# Altium schematic sheet CLOCK.SchDoc
size 558 x 431 mm; SheetNumber: 5; SheetTotal: 25; Sheet_Name: CLOCK; Size: 11x17
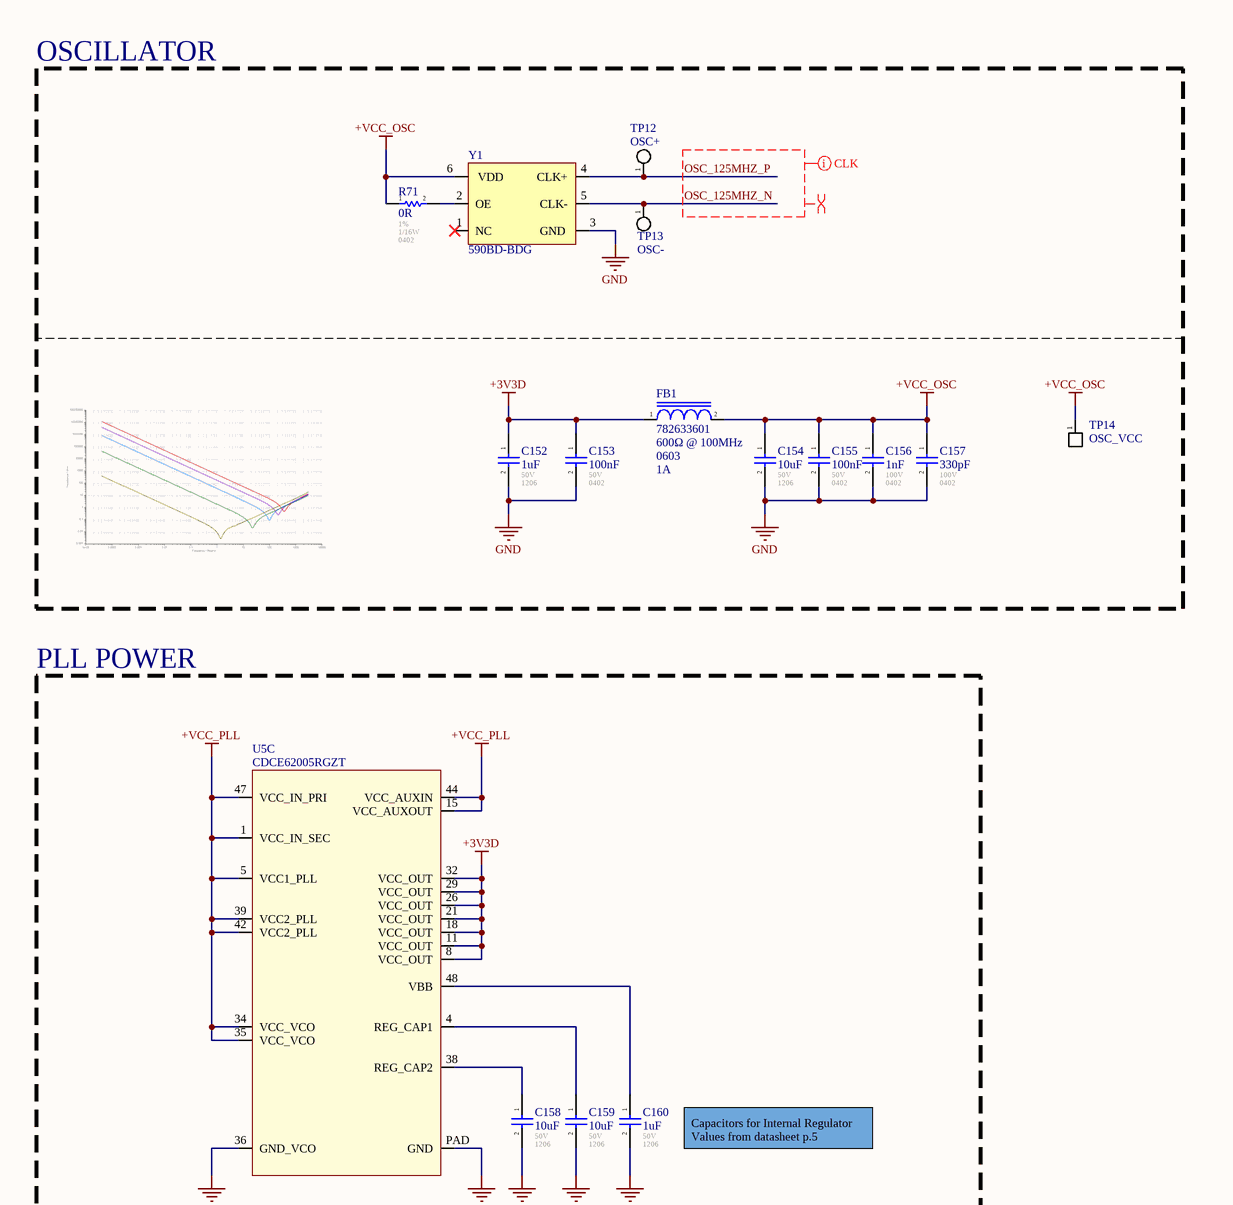
[diagram p0: CLOCK.SchDoc, top left]
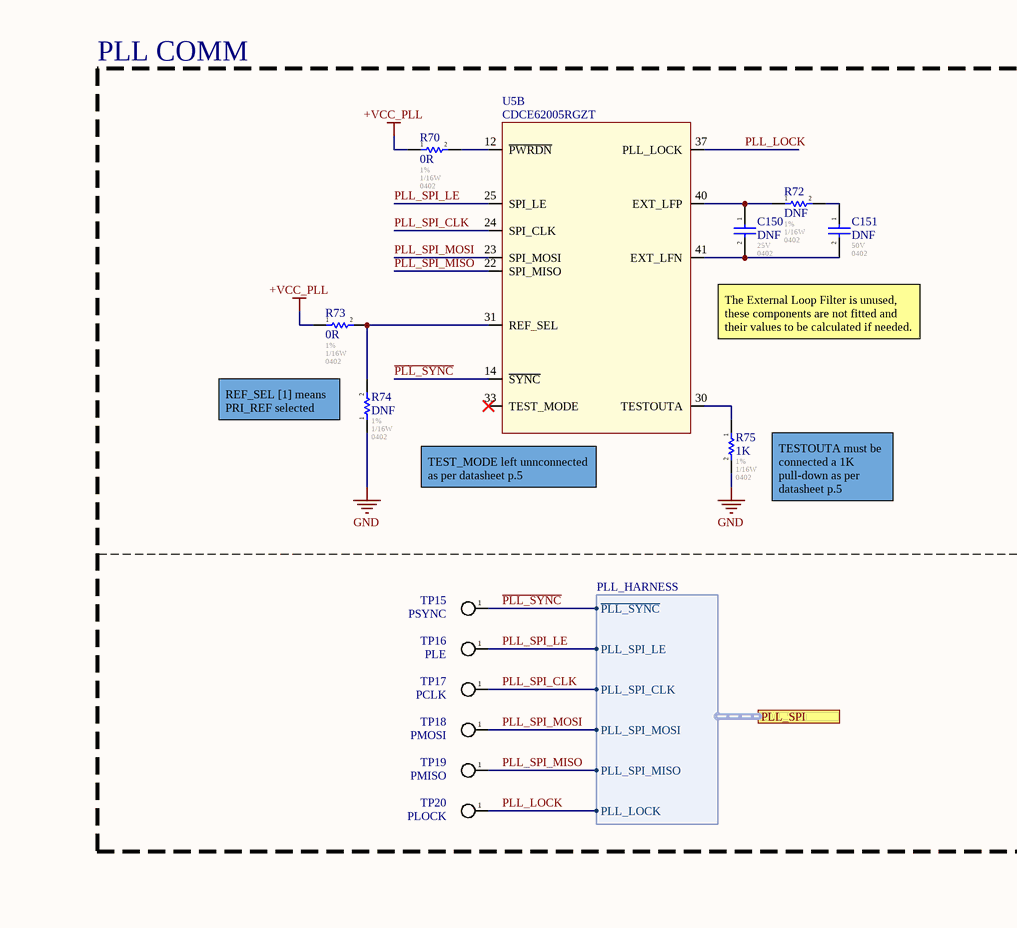
[diagram p1: CLOCK.SchDoc, top right]
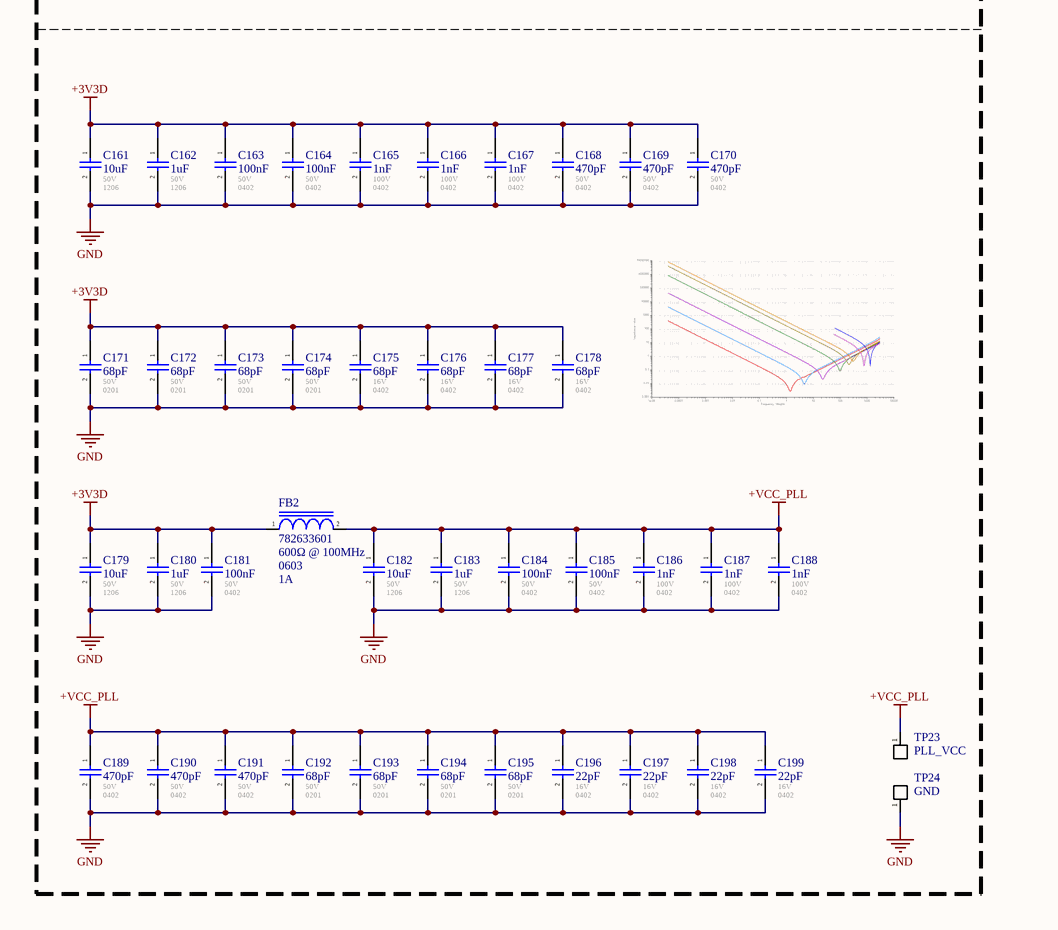
[diagram p2: CLOCK.SchDoc, bottom left]
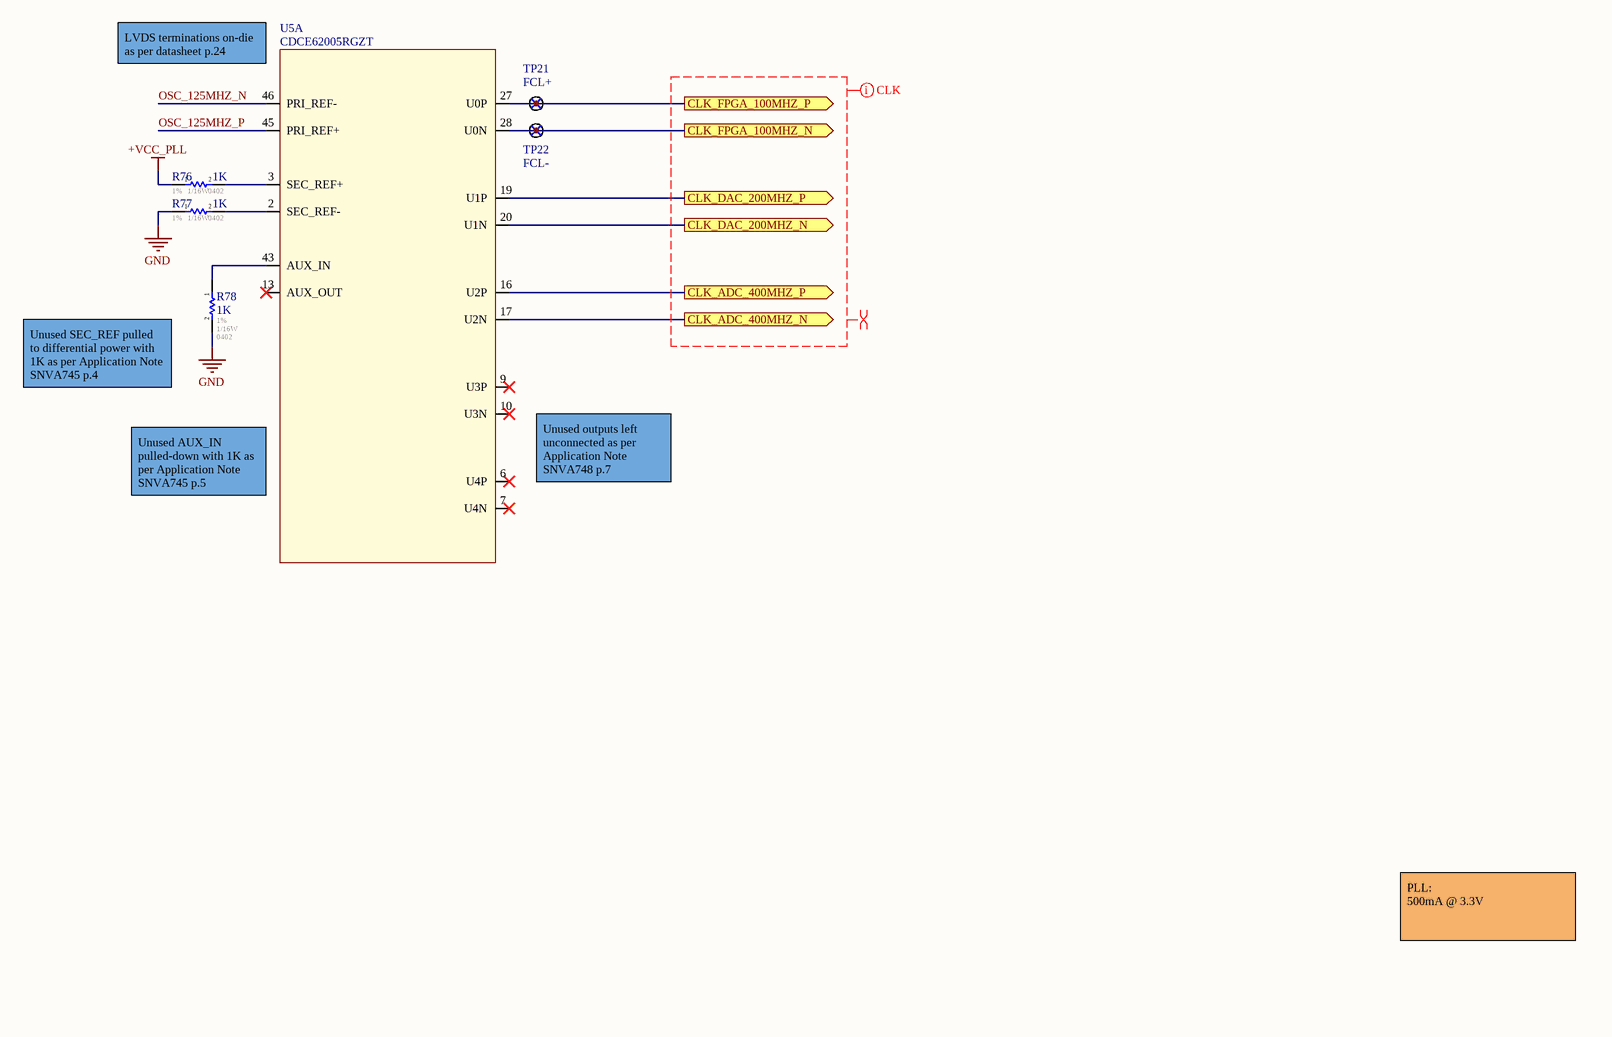
[diagram p3: CLOCK.SchDoc, bottom right]

## Parts
C150  DNF  Voltage - Rated: 25V  Footprint: 0402  [CAP_0402]
C151  DNF  Voltage - Rated: 50V  Footprint: 0402  [CAP_0402]
C152  1uF  Voltage - Rated: 50V  Footprint: 1206  [CAP_1206]
C153  100nF  Voltage - Rated: 50V  Footprint: 0402  [CAP_0402]
C154  10uF  Voltage - Rated: 50V  Footprint: 1206  [CAP_1206]
C155  100nF  Voltage - Rated: 50V  Footprint: 0402  [CAP_0402]
C156  1nF  Voltage - Rated: 100V  Footprint: 0402  [CAP_0402]
C157  330pF  Voltage - Rated: 100V  Footprint: 0402  [CAP_0402]
C158  10uF  Voltage - Rated: 50V  Footprint: 1206  [CAP_1206]
C159  10uF  Voltage - Rated: 50V  Footprint: 1206  [CAP_1206]
C160  1uF  Voltage - Rated: 50V  Footprint: 1206  [CAP_1206]
C161  10uF  Voltage - Rated: 50V  Footprint: 1206  [CAP_1206]
C162  1uF  Voltage - Rated: 50V  Footprint: 1206  [CAP_1206]
C163  100nF  Voltage - Rated: 50V  Footprint: 0402  [CAP_0402]
C164  100nF  Voltage - Rated: 50V  Footprint: 0402  [CAP_0402]
C165  1nF  Voltage - Rated: 100V  Footprint: 0402  [CAP_0402]
C166  1nF  Voltage - Rated: 100V  Footprint: 0402  [CAP_0402]
C167  1nF  Voltage - Rated: 100V  Footprint: 0402  [CAP_0402]
C168  470pF  Voltage - Rated: 50V  Footprint: 0402  [CAP_0402]
C169  470pF  Voltage - Rated: 50V  Footprint: 0402  [CAP_0402]
C170  470pF  Voltage - Rated: 50V  Footprint: 0402  [CAP_0402]
C171  68pF  Voltage - Rated: 50V  Footprint: 0201  [CAP_0402]
C172  68pF  Voltage - Rated: 50V  Footprint: 0201  [CAP_0402]
C173  68pF  Voltage - Rated: 50V  Footprint: 0201  [CAP_0402]
C174  68pF  Voltage - Rated: 50V  Footprint: 0201  [CAP_0402]
C175  68pF  Voltage - Rated: 16V  Footprint: 0402  [CAP_0402]
C176  68pF  Voltage - Rated: 16V  Footprint: 0402  [CAP_0402]
C177  68pF  Voltage - Rated: 16V  Footprint: 0402  [CAP_0402]
C178  68pF  Voltage - Rated: 16V  Footprint: 0402  [CAP_0402]
C179  10uF  Voltage - Rated: 50V  Footprint: 1206  [CAP_1206]
C180  1uF  Voltage - Rated: 50V  Footprint: 1206  [CAP_1206]
C181  100nF  Voltage - Rated: 50V  Footprint: 0402  [CAP_0402]
C182  10uF  Voltage - Rated: 50V  Footprint: 1206  [CAP_1206]
C183  1uF  Voltage - Rated: 50V  Footprint: 1206  [CAP_1206]
C184  100nF  Voltage - Rated: 50V  Footprint: 0402  [CAP_0402]
C185  100nF  Voltage - Rated: 50V  Footprint: 0402  [CAP_0402]
C186  1nF  Voltage - Rated: 100V  Footprint: 0402  [CAP_0402]
C187  1nF  Voltage - Rated: 100V  Footprint: 0402  [CAP_0402]
C188  1nF  Voltage - Rated: 100V  Footprint: 0402  [CAP_0402]
C189  470pF  Voltage - Rated: 50V  Footprint: 0402  [CAP_0402]
C190  470pF  Voltage - Rated: 50V  Footprint: 0402  [CAP_0402]
C191  470pF  Voltage - Rated: 50V  Footprint: 0402  [CAP_0402]
C192  68pF  Voltage - Rated: 50V  Footprint: 0201  [CAP_0402]
C193  68pF  Voltage - Rated: 50V  Footprint: 0201  [CAP_0402]
C194  68pF  Voltage - Rated: 50V  Footprint: 0201  [CAP_0402]
C195  68pF  Voltage - Rated: 50V  Footprint: 0201  [CAP_0402]
C196  22pF  Voltage - Rated: 16V  Footprint: 0402  [CAP_0402]
C197  22pF  Voltage - Rated: 16V  Footprint: 0402  [CAP_0402]
C198  22pF  Voltage - Rated: 16V  Footprint: 0402  [CAP_0402]
C199  22pF  Voltage - Rated: 16V  Footprint: 0402  [CAP_0402]
FB1  782633601  Impedance @ Freq: 600Ω @ 100MHz  Package / Case: 0603  Current Rating: 1A  [IND_0603]
FB2  782633601  Impedance @ Freq: 600Ω @ 100MHz  Package / Case: 0603  Current Rating: 1A  [IND_0603]
R70  0R  Tolerance: 1%  Power: 1/16W  Package / Case: 0402  [RES_0402]
R71  0R  Tolerance: 1%  Power: 1/16W  Package / Case: 0402  [RES_0402]
R72  DNF  Tolerance: 1%  Power: 1/16W  Package / Case: 0402  [RES_0402]
R73  0R  Tolerance: 1%  Power: 1/16W  Package / Case: 0402  [RES_0402]
R74  DNF  Tolerance: 1%  Power: 1/16W  Package / Case: 0402  [RES_0402]
R75  1K  Tolerance: 1%  Power: 1/16W  Package / Case: 0402  [RES_0402]
R76  1K  Tolerance: 1%  Power: 1/16W  Package / Case: 0402  [RES_0402]
R77  1K  Tolerance: 1%  Power: 1/16W  Package / Case: 0402  [RES_0402]
R78  1K  Tolerance: 1%  Power: 1/16W  Package / Case: 0402  [RES_0402]
TP12  OSC+  [TP_PAD_SMALL]  (no BOM)
TP13  OSC-  [TP_PAD_SMALL]  (no BOM)
TP14  OSC_VCC  [TP_PAD]  (no BOM)
TP15  PSYNC  [TP_PAD_SMALL]  (no BOM)
TP16  PLE  [TP_PAD_SMALL]  (no BOM)
TP17  PCLK  [TP_PAD_SMALL]  (no BOM)
TP18  PMOSI  [TP_PAD_SMALL]  (no BOM)
TP19  PMISO  [TP_PAD_SMALL]  (no BOM)
TP20  PLOCK  [TP_PAD_SMALL]  (no BOM)
TP21  FCL+  [TP_PAD_TINY]  (no BOM)
TP22  FCL-  [TP_PAD_TINY]  (no BOM)
TP23  PLL_VCC  [TP_PAD]  (no BOM)
TP24  GND  [TP_PAD]  (no BOM)
U5  CDCE62005RGZT  [TIM_CDCE62005RGZT]  (parts A,B,C of 3)
Y1  590BD-BDG  [OSC_590BD-BDG]

## Blocks framed on the sheet
OSCILLATOR: C152-C157 FB1 R71 TP12-TP14 Y1
PLL COMM: C150 C151 R70 R72-R75 TP15-TP20 U5
PLL POWER: C158-C199 FB2 TP23 TP24 U5

## Ports
CLK_ADC_400MHZ_N (out), CLK_ADC_400MHZ_P (out), CLK_DAC_200MHZ_N (out), CLK_DAC_200MHZ_P (out), CLK_FPGA_100MHZ_N (out), CLK_FPGA_100MHZ_P (out), PLL_SPI (harness PLL_HARNESS)

## Harnesses
PLL_HARNESS: ~{PLL_SYNC}, PLL_SPI_LE, PLL_SPI_CLK, PLL_SPI_MOSI, PLL_SPI_MISO, PLL_LOCK

## Nets
+3V3D: C152.1 C153.1 C161.1 C162.1 C163.1 C164.1 C165.1 C166.1 C167.1 C168.1 C169.1 C170.1 C171.1 C172.1 C173.1 C174.1 C175.1 C176.1 C177.1 C178.1 C179.1 C180.1 C181.1 FB1.1 FB2.1 U5.8(VCC_OUT) U5.11(VCC_OUT) U5.18(VCC_OUT) U5.21(VCC_OUT) U5.26(VCC_OUT) U5.29(VCC_OUT) U5.32(VCC_OUT)
+VCC_OSC: C154.1 C155.1 C156.1 C157.1 FB1.2 R71.1 TP14.1(A) Y1.6(VDD)
+VCC_PLL: C182.1 C183.1 C184.1 C185.1 C186.1 C187.1 C188.1 C189.1 C190.1 C191.1 C192.1 C193.1 C194.1 C195.1 C196.1 C197.1 C198.1 C199.1 FB2.2 R70.1 R73.1 R76.1 TP23.1(A) U5.1(VCC_IN_SEC) U5.5(VCC1_PLL) U5.15(VCC_AUXOUT) U5.34(VCC_VCO) U5.35(VCC_VCO) U5.39(VCC2_PLL) U5.42(VCC2_PLL) U5.44(VCC_AUXIN) U5.47(VCC_IN_PRI)
GND: C152.2 C153.2 C154.2 C155.2 C156.2 C157.2 C158.2 C159.2 C160.2 C161.2 C162.2 C163.2 C164.2 C165.2 C166.2 C167.2 C168.2 C169.2 C170.2 C171.2 C172.2 C173.2 C174.2 C175.2 C176.2 C177.2 C178.2 C179.2 C180.2 C181.2 C182.2 C183.2 C184.2 C185.2 C186.2 C187.2 C188.2 C189.2 C190.2 C191.2 C192.2 C193.2 C194.2 C195.2 C196.2 C197.2 C198.2 C199.2 R74.1 R75.2 R77.1 R78.2 TP24.1(A) U5.36(GND_VCO) U5.PAD(GND) Y1.3(GND)
~{PLL_SYNC}: TP15.1(A) U5.14(~{SYNC}) ; port PLL_SPI.~{PLL_SYNC}
CLK_ADC_400MHZ_N: U5.17(U2N) ; port CLK_ADC_400MHZ_N
CLK_ADC_400MHZ_P: U5.16(U2P) ; port CLK_ADC_400MHZ_P
CLK_DAC_200MHZ_N: U5.20(U1N) ; port CLK_DAC_200MHZ_N
CLK_DAC_200MHZ_P: U5.19(U1P) ; port CLK_DAC_200MHZ_P
CLK_FPGA_100MHZ_N: TP22.1(A) U5.28(U0N) ; port CLK_FPGA_100MHZ_N
CLK_FPGA_100MHZ_P: TP21.1(A) U5.27(U0P) ; port CLK_FPGA_100MHZ_P
OSC_125MHZ_N: TP13.1(A) U5.46(PRI_REF-) Y1.5(CLK-)
OSC_125MHZ_P: TP12.1(A) U5.45(PRI_REF+) Y1.4(CLK+)
PLL_LOCK: TP20.1(A) U5.37(PLL_LOCK) ; port PLL_SPI.PLL_LOCK
PLL_SPI_CLK: TP17.1(A) U5.24(SPI_CLK) ; port PLL_SPI.PLL_SPI_CLK
PLL_SPI_LE: TP16.1(A) U5.25(SPI_LE) ; port PLL_SPI.PLL_SPI_LE
PLL_SPI_MISO: TP19.1(A) U5.22(SPI_MISO) ; port PLL_SPI.PLL_SPI_MISO
PLL_SPI_MOSI: TP18.1(A) U5.23(SPI_MOSI) ; port PLL_SPI.PLL_SPI_MOSI
NetC150_1: C150.1 R72.1 U5.40(EXT_LFP)
NetC150_2: C150.2 C151.2 U5.41(EXT_LFN)
NetC151_1: C151.1 R72.2
NetC158_1: C158.1 U5.38(REG_CAP2)
NetC159_1: C159.1 U5.4(REG_CAP1)
NetC160_1: C160.1 U5.48(VBB)
NetR70_2: R70.2 U5.12(~{PWRDN})
NetR71_2: R71.2 Y1.2(OE)
NetR73_2: R73.2 R74.2 U5.31(REF_SEL)
NetR75_1: R75.1 U5.30(TESTOUTA)
NetR76_2: R76.2 U5.3(SEC_REF+)
NetR77_2: R77.2 U5.2(SEC_REF-)
NetR78_1: R78.1 U5.43(AUX_IN)

Not connected (* = marked no-connect by the designer): U5 6(U4P)* 7(U4N)* 9(U3P)* 10(U3N)* 13(AUX_OUT)* 33(TEST_MODE)*; Y1 1(NC)*

## Layout directives
differential pair: (no net found under the mark), OSC_125MHZ_N, OSC_125MHZ_P
net class CLK: (no net found under the mark), OSC_125MHZ_N, OSC_125MHZ_P

## Notes on the sheet
- The External Loop Filter is unused, these components are not fitted and their values to be calculated if needed.
- (near R74) REF_SEL [1] means PRI_REF selected
- TEST_MODE left unnconnected as per datasheet p.5
- (near R75) TESTOUTA must be connected a 1K pull-down as per datasheet p.5
- (near U5) LVDS terminations on-die as per datasheet p.24
- Capacitors for Internal Regulator
  Values from datasheet p.5
- (near R78) Unused SEC_REF pulled to differential power with 1K as per Application Note SNVA745 p.4
- (near U5) Unused outputs left unconnected as per Application Note SNVA748 p.7
- (near U5) Unused AUX_IN pulled-down with 1K as per Application Note SNVA745 p.5
- PLL:
  500mA @ 3.3V
- Sheet Name
- Project Title
- Global Project
- Revision
- Size
- Date
- Group
- Sheet
- of
- Filename
- Designers

## Library data of the parts
C150 = CAP_CER: Temperature Coefficient: X7R; Operating Temperature: *; Mfr: *; ComponentLink1Description: Digikey; ComponentLink1URL: [Digikey Link]; Digikey Part No: *; ComponentLink2Description: Datasheet; ComponentLink2URL: [Datasheet Link]
C151 = CAP_CER: 0402 100nF X7R Ceramic Capacitor; Operating Temperature: *; Temperature Coefficient: X7R; Mfr: *; ComponentLink1Description: Digikey; ComponentLink1URL: [Digikey Link]; Digikey Part No: *; ComponentLink2Description: Datasheet; ComponentLink2URL: [Datasheet Link]
C152 C160 C162 C180 C183 = CAP_CER: GCJ31CR71H105KA12L / 1206 1uF 10% X7R Ceramic Capacitor; Mfr: Murata; Operating Temperature: -55C - 125C; Temperature Coefficient: X7R; ComponentLink1Description: Digikey; ComponentLink1URL: [Digikey Link]; Part#: GCJ31CR71H105KA12L; ComponentLink2Description: Datasheet; ComponentLink2URL: [Datasheet Link]; Tolerance: 10%; Ratings: AEC-Q200
C153 C155 C163 C164 C181 C184 C185 = CAP_CER: GCM155R71H104KE02J / 0402 100nF 10% X7R Ceramic Capacitor; Mfr: Murata; Operating Temperature: -55C - 125C; Temperature Coefficient: X7R; ComponentLink1Description: Digikey; ComponentLink1URL: [Digikey Link]; Part#: GCM155R71H104KE02J; ComponentLink2Description: Datasheet; ComponentLink2URL: [Datasheet Link]; Tolerance: 10%; Ratings: AEC-Q200
C154 C158 C159 C161 C179 C182 = CAP_CER: GRT31CR61H106KE01L / 1206 10uF 10% X5R Ceramic Capacitor; Mfr: Murata; Operating Temperature: -55C - 85C; Temperature Coefficient: X5R; ComponentLink1Description: Digikey; ComponentLink1URL: [Digikey Link]; ComponentLink2Description: Datasheet; ComponentLink2URL: [Datasheet Link]; Tolerance: 10%; Ratings: AEC-Q200; Part#: GRT31CR61H106KE01L
C156 C165-C167 C186-C188 = CAP_CER: GCM155R72A102KA37D / 0402 1nF 10% X7R Ceramic Capacitor; Mfr: Murata; Operating Temperature: -55C - 125C; Temperature Coefficient: X7R; ComponentLink1Description: Digikey; ComponentLink1URL: [Digikey Link]; Part#: GCM155R72A102KA37D; ComponentLink2Description: Datasheet; ComponentLink2URL: [Datasheet Link]; Tolerance: 10%; Ratings: AEC-Q200
C157 = CAP_CER: GCM155R72A331KA37D / 0402 330pF 10% X7R Ceramic Capacitor; Mfr: Murata; Operating Temperature: -55C - 125C; Temperature Coefficient: X7R; ComponentLink1Description: Digikey; ComponentLink1URL: https://www.digikey.ca/en/products/detail/murata-electronics/GCM155R72A331KA37D/2591348; Part#: GCM155R72A331KA37D; ComponentLink2Description: Datasheet; ComponentLink2URL: https://search.murata.co.jp/Ceramy/image/img/A01X/G101/ENG/GCM155R72A331KA37-01A.pdf; Tolerance: 10%; Ratings: AEC-Q200; ComponentLink3Description: Murata; ComponentLink3URL: https://www.murata.com/en-us/products/productdetail?partno=GCM155R72A331KA37%23; ComponentLink4Description: Octopart; ComponentLink4URL: https://octopart.com/gcm155r72a331ka37d-murata-18331888?r=sp; Supplier 1: Arrow Electronics; Supplier Part Number 1: GCM155R72A331KA37D
C168-C170 C189-C191 = CAP_CER: GCM155R71H471KA37J / 0402 470pF 10% X7R Ceramic Capacitor; Mfr: Murata; Operating Temperature: -55C - 125C; Temperature Coefficient: X7R; ComponentLink1Description: Digikey; ComponentLink1URL: https://www.digikey.ca/en/products/detail/murata-electronics/GCM155R71H471KA37J/2591324; Part#: GCM155R71H471KA37J; ComponentLink2Description: Datasheet; ComponentLink2URL: https://search.murata.co.jp/Ceramy/image/img/A01X/G101/ENG/GCM155R71H471KA37-01A.pdf; Tolerance: 10%; Ratings: AEC-Q200; ComponentLink3Description: Murata; ComponentLink3URL: https://www.murata.com/en-us/products/productdetail?partno=GCM155R71H471KA37%23; ComponentLink4Description: Octopart; ComponentLink4URL: https://octopart.com/gcm155r71h471ka37j-murata-17803389?r=sp
C171-C174 C192-C195 = CAP_CER: 0201 68pF 5% C0G 50V Ceramic Capacitor / CGA1A2C0G1H680J030BA; Mfr: TDK; Operating Temperature: -55C - 125C; Temperature Coefficient: C0G; ComponentLink1Description: Digikey; ComponentLink1URL: https://www.digikey.ca/en/products/detail/tdk-corporation/CGA1A2C0G1H680J030BA/3648597; Part#: CGA1A2C0G1H680J030BA; ComponentLink2Description: Datasheet; ComponentLink2URL: https://product.tdk.com/system/files/dam/doc/product/capacitor/ceramic/mlcc/charasheet/cga1a2c0g1h680j030ba.pdf; Tolerance: 5%; Ratings: AEC-Q200; ComponentLink3Description: Octopart; ComponentLink3URL: https://octopart.com/cga1a2c0g1h680j030ba-tdk-26014371?r=sp; ComponentLink4Description: TDK; ComponentLink4URL: https://product.tdk.com/en/search/capacitor/ceramic/mlcc/info?part_no=CGA1A2C0G1H680J030BA; Supplier 1: Arrow Electronics; Supplier Part Number 1: CGA1A2C0G1H680J030BA
C175-C178 C196-C199 = CAP_CER: 0402 22pF 10% X7R 16V Ceramic Capacitor / C0402C220K4RACAUTO; Mfr: KEMET; Operating Temperature: -55C - 125C; Temperature Coefficient: X7R; ComponentLink1Description: Digikey; ComponentLink1URL: https://www.digikey.ca/en/products/detail/kemet/c0402c220k4racauto/11676432; Part#: C0402C220K4RACAUTO; ComponentLink2Description: Datasheet; ComponentLink2URL: https://connect.kemet.com:7667/gateway/IntelliData-ComponentDocumentation/1.0/download/datasheet/C0402C220K4RACAUTO; Tolerance: 10%; Ratings: AEC-Q200; ComponentLink3Description: Octopart; ComponentLink3URL: https://octopart.com/c0402c220k4racauto-kemet-91893749?r=sp; ComponentLink4Description: Kemet; ComponentLink4URL: https://www.kemet.com/en/us/capacitors/ceramic/product/C0402C220K4RACAUTO.html; ComponentLink5Description: Specsheet; ComponentLink5URL: https://search.kemet.com/component-documentation/download/specsheet/C0402C220K4RACAUTO; Supplier 1: Mouser; Supplier Part Number 1: 80-C0402C220K4RAUTO
FB1 FB2 = FERRITE_BEAD: 600 Ohms @ 100 MHz 1 Signal Line Ferrite Bead 0603 (1608 Metric) 1A 200mOhm; Manufacturer: Wurth Elektronik; Resistance: 200mR; Operating Temperature: -55C - 125C; Rating: AEC-Q200; ComponentLink1Description: Digikey; ComponentLink1URL: https://www.digikey.ca/en/products/detail/w%C3%BCrth-elektronik/782633601/5168802; ComponentLink3Description: Octopart; ComponentLink3URL: https://octopart.com/782633601-wurth+elektronik-56466764; Supplier 1: Digikey; Supplier Part Number 1: 732-6703-1-ND; ComponentLink5Description: Datasheet; ComponentLink5URL: https://www.we-online.com/components/products/datasheet/782633601.pdf
R70-R78 = RESISTOR: Automotive: AEC-Q200; Operating Temperature: *; # Digikey: *; ComponentLink1Description: Digikey; ComponentLink1URL: *; # Manufacturer: *
TP12 TP13 TP15-TP20 = TESTPOINT_PAD_SMALL: Test Point
TP14 TP23 TP24 = TESTPOINT_PAD: Test Point
TP21 TP22 = TESTPOINT_PAD_TINY: Test Point
U5 = TIM_CDCE62005RGZT: TIM - CLK SYNTH JITTER CLEANER 3:5 - QFN-48; Voltage: 3 V ~ 3.6 V; Mfg: Texas Instruments; Current: *; Power: *; Mfg Part Number: CDCE62005RGZT; HelpURL: http://www.ti.com/lit/ds/symlink/cdce62005.pdf; CreatedBy: Jonathan Bouchard; Temperature: -40°C ~ 85°C; Value: *; Precision: *; Package: QFN-48; Supplier 1: Digikey; Supplier Part Number 1: 296-23947-1-ND
Y1 = OSC_590BD-BDG: TIM - OSC PROG 125MHz ~ 214.999MHz LVDS 3.3V 7PPM EN/DS - 6-SMD; Manufacturer #1: Silicon Labs; Current Rating: 100 mA (supply); Note: Spécifié la fréquence lors de la commande; Voltage rating: 3.3V (supply); Polarized: Yes; Value: ±7ppm (freq Stability), ±20ppm (freq stability total); Magnetic Material: UNKNOWN; GRAMS Lib Spec: 2.8; Manufacturer #2: *; Power Max: *; Part Number #1: 590BD-BDG; Part Number #2: *; HelpURL: https://www.silabs.com/documents/public/data-sheets/Si590-591.pdf; Supplier 1: Digi-Key; Supplier Part Number 1: 590BD-BDG-ND; Assembly Type: SMD; Temperature: -40°C ~ 85°C; Package: 6-SMD; CreatedBy/Date: from 590BD-CDG; Tolerance: *; VerifiedBy: Caroline Paulin / 3/10/2019; Cryo: UNKNOWN